# Altium schematic sheet Connector USB-C TH USB2.0.SchDoc
size Letter
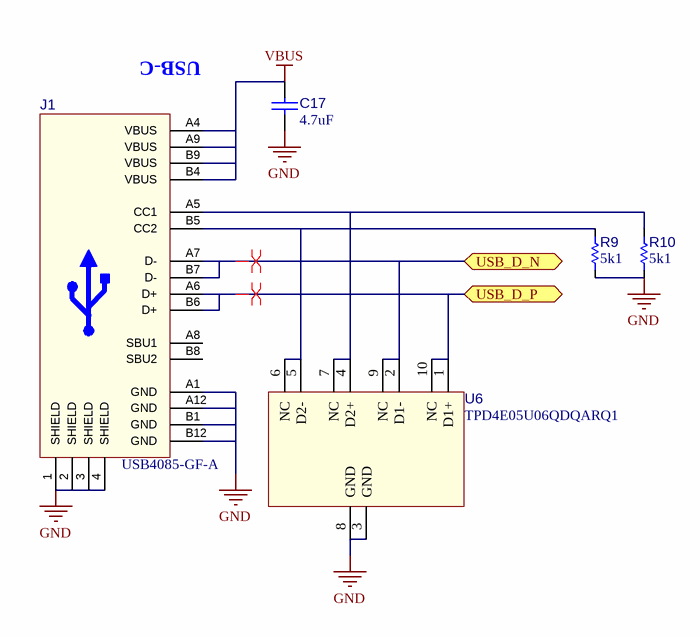
[diagram p0: Connector USB-C TH USB2.0.SchDoc]

## Parts
C17  value 4.7uF  [C_2012[0805]]  (hidden comment: Cap 4.7uF 0805)
J1  USB4085-GF-A  [FP-USB4085-GF-A-MFG]
R9  value 5k1  [R_1005[0402]]  (hidden comment: Res 5k1 1% 0402)
R10  value 5k1  [R_1005[0402]]  (hidden comment: Res 5k1 1% 0402)
U6  TPD4E05U06QDQARQ1  [U_USON50P250X100-10]

## Ports
USB_D_N (bidir, see 243-336_MP_Manette[1D], 243-336_MP_Controleur-Interface[2B]), USB_D_P (bidir, see 243-336_MP_Manette[1D], 243-336_MP_Controleur-Interface[2B])

## Nets
GND: C17.1 J1.1(SHIELD) J1.2(SHIELD) J1.3(SHIELD) J1.4(SHIELD) J1.A1(GND) J1.A12(GND) J1.B1(GND) J1.B12(GND) R9.1 R10.1 U6.3(GND) U6.8(GND)
VBUS: C17.2 J1.A4(VBUS) J1.A9(VBUS) J1.B4(VBUS) J1.B9(VBUS)
USB_D_N: J1.A7(D-) J1.B7(D-) U6.2(D1-) U6.9(NC) ; port USB_D_N
USB_D_P: J1.A6(D+) J1.B6(D+) U6.1(D1+) U6.10(NC) ; port USB_D_P
NetJ1_A5: J1.A5(CC1) R10.2 U6.4(D2+) U6.7(NC)
NetJ1_B5: J1.B5(CC2) R9.2 U6.5(D2-) U6.6(NC)

Not connected (* = marked no-connect by the designer): J1 A8(SBU1) B8(SBU2)

## Layout directives
differential pair: USB_D_N, USB_D_P

## Notes on the sheet
- (near J1) USB-C

## Library data of the parts
C17 = CAP003: Capacitor type 1; Manufacturer 1: Taiyo Yuden; Manufacturer Part Number 1: TMK212AB7475KG-T; LibRef: CAP003; CEGEP: KCOND02SM; Tolerance: 10%; Rated Voltage: 25V; Dielectric: X7R; Supplier 1: LCSC; Supplier Part Number 1: C163186; Mounting Technology: SMT
J1 = J_USB-C_16pos: CONN RCPT USB2.0 TYPE C RA - TH; Manufacturer 1: Global Connector Technology; Manufacturer Part Number 1: USB4085-GF-A; Mounting Technology: TH; Supplier 1: LCSC; Supplier 2: Digikey; Supplier Part Number 1: C7095263; Supplier Part Number 2: 2073-USB4085-GF-ACT-ND
R9 R10 = RES010: Resistor type 1; Manufacturer 1: Panasonic; Manufacturer Part Number 1: ERJ-2RKF5101X; LibRef: RES010; Puissance: 1/16W; Max Working Voltage: 50V; Tolerance: 1%; Supplier 1: LCSC; Supplier Part Number 1: C25905; Mounting Technology: SMT
U6 = U_TPD4E05U06: TVS DIODE 5.5V 14V 10USON; Manufacturer 1: Texas Instruments; Manufacturer 2: ElecSuper; Manufacturer Part Number 2: TPD4E05U06QDQARQ1-ES; Manufacturer Part Number 1: TPD4E05U06QDQARQ1; Mounting Technology: SMT; Supplier 1: LCSC; Supplier 2: Digikey; Supplier Part Number 1: C81353; Supplier Part Number 2: 296-40696-1-ND